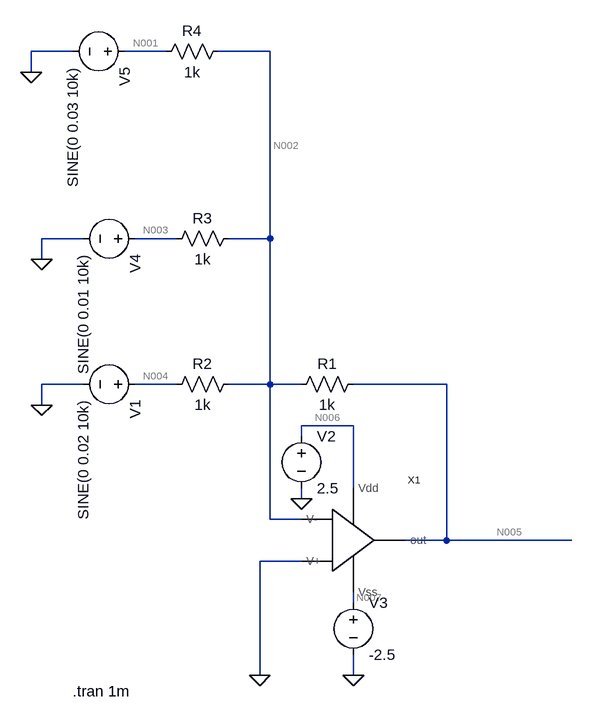
[diagram p0: schematic 2e.asc]
2e.asc, the LTspice schematic file:
Version 4
SHEET 1 880 680
WIRE -144 -592 -208 -592
WIRE 0 -592 -64 -592
WIRE 160 -592 80 -592
WIRE -208 -560 -208 -592
WIRE -128 -304 -192 -304
WIRE 16 -304 -48 -304
WIRE 160 -304 160 -592
WIRE 160 -304 96 -304
WIRE -192 -272 -192 -304
WIRE -128 -80 -192 -80
WIRE 16 -80 -48 -80
WIRE 160 -80 160 -304
WIRE 160 -80 96 -80
WIRE 208 -80 160 -80
WIRE 432 -80 288 -80
WIRE -192 -48 -192 -80
WIRE 288 -16 208 -16
WIRE 208 0 208 -16
WIRE 288 80 288 -16
WIRE 208 96 208 80
WIRE 160 128 160 -80
WIRE 208 128 160 128
WIRE 432 160 432 -80
WIRE 432 160 368 160
WIRE 624 160 432 160
WIRE 208 192 144 192
WIRE 288 256 288 240
WIRE 144 368 144 192
WIRE 288 368 288 336
FLAG 144 368 0
FLAG 288 368 0
FLAG 208 96 0
FLAG -192 -48 0
FLAG -192 -272 0
FLAG -208 -560 0
SYMBOL res 304 -96 R90
WINDOW 0 0 56 VBottom 2
WINDOW 3 32 56 VTop 2
SYMATTR InstName R1
SYMATTR Value 1k
SYMBOL voltage -32 -80 R90
WINDOW 123 24 44 Left 2
WINDOW 39 0 0 Left 0
SYMATTR InstName V1
SYMATTR Value SINE(0 0.02 10k)
SYMBOL voltage 208 -16 R0
WINDOW 123 0 0 Left 0
WINDOW 39 0 0 Left 0
SYMATTR InstName V2
SYMATTR Value 2.5
SYMBOL voltage 288 240 R0
WINDOW 123 0 0 Left 0
WINDOW 39 0 0 Left 0
SYMATTR InstName V3
SYMATTR Value -2.5
SYMBOL res 112 -96 R90
WINDOW 0 0 56 VBottom 2
WINDOW 3 32 56 VTop 2
SYMATTR InstName R2
SYMATTR Value 1k
SYMBOL OPAMP 176 160 R0
SYMATTR InstName X1
SYMBOL voltage -32 -304 R90
WINDOW 123 24 44 Left 2
WINDOW 39 0 0 Left 0
SYMATTR InstName V4
SYMATTR Value SINE(0 0.01 10k)
SYMBOL res 112 -320 R90
WINDOW 0 0 56 VBottom 2
WINDOW 3 32 56 VTop 2
SYMATTR InstName R3
SYMATTR Value 1k
SYMBOL voltage -48 -592 R90
WINDOW 123 24 44 Left 2
WINDOW 39 0 0 Left 0
SYMATTR InstName V5
SYMATTR Value SINE(0 0.03 10k)
SYMBOL res 96 -608 R90
WINDOW 0 0 56 VBottom 2
WINDOW 3 32 56 VTop 2
SYMATTR InstName R4
SYMATTR Value 1k
TEXT -144 392 Left 2 !.tran 1m

The netlist it stands for:
* 2e.asc
R1 N005 N002 1k
V1 N004 0 SINE(0 0.02 10k)
V2 N006 0 2.5
V3 N007 0 -2.5
R2 N002 N004 1k
XX1 N006 N007 N002 0 N005 OPAMP  ; pins Vdd Vss V- V+ out
V4 N003 0 SINE(0 0.01 10k)
R3 N002 N003 1k
V5 N001 0 SINE(0 0.03 10k)
R4 N002 N001 1k
.tran 1m
.backanno
.end

* Results of the author's LTspice run, read from the files saved beside the schematic
* Operating Point, zero values left out:
*   V(n005) = 187.5 µV
*   V(n002) = 46.89 µV
*   V(n006) = 2.5 V
*   V(n007) = -2.5 V
*   I(R1) = 140.7 nA
*   I(R2) = 46.89 nA
*   I(R3) = 46.89 nA
*   I(R4) = 46.89 nA
*   I(V1) = 46.89 nA
*   I(V2) = -188.6 µA
*   I(V3) = 188.4 µA
*   I(V4) = 46.89 nA
*   I(V5) = 46.89 nA
*   Ix(x1:VDD) = 188.6 µA
*   Ix(x1:VSS) = -188.4 µA
*   Ix(x1:OUT) = -140.7 nA
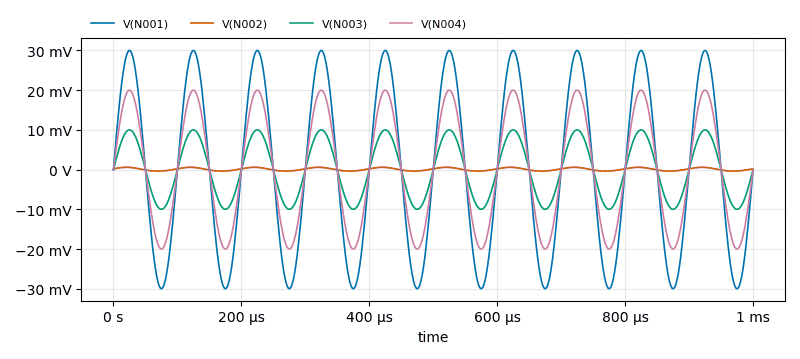
[diagram p1: Transient Analysis of 2e.asc, plotted from the saved traces]
* Transient Analysis, 1 run:
*   V(N001): min -30 mV, max 30 mV, average -9.708 nV, rms 21.22 mV, last 0 V
*   V(N002): min -383.7 µV, max 581.1 µV, average 72.73 µV, rms 347 µV, last 195.6 µV
*   V(N003): min -10 mV, max 10 mV, average -3.241 nV, rms 7.072 mV, last 0 V
*   V(N004): min -20 mV, max 20 mV, average -6.482 nV, rms 14.14 mV, last 0 V